# Altium schematic sheet C40_IMB_Upgrade_OVERVIEW.SCHDOC
size 812 x 571 mm; DocumentNumber: 2; SheetNumber: 2; SheetTotal: 7; PageSetup: Record=PageOptions|CenterHorizontal=True|CenterVertical=True|PrintScale=0.46|XCorrection=1.00|YCorrection=1.00|PrintKind=0|BorderSize=5000000|LeftOffset=0|BottomOffset=0|Orientation=2|PaperLength=1000|PaperWidth=1000|Scale=100|PaperSource=259|PrintQuality=600|MediaType=1|DitherType=10|PaperKind=Letter (8.5 x 11")|PrintScaleMode=0
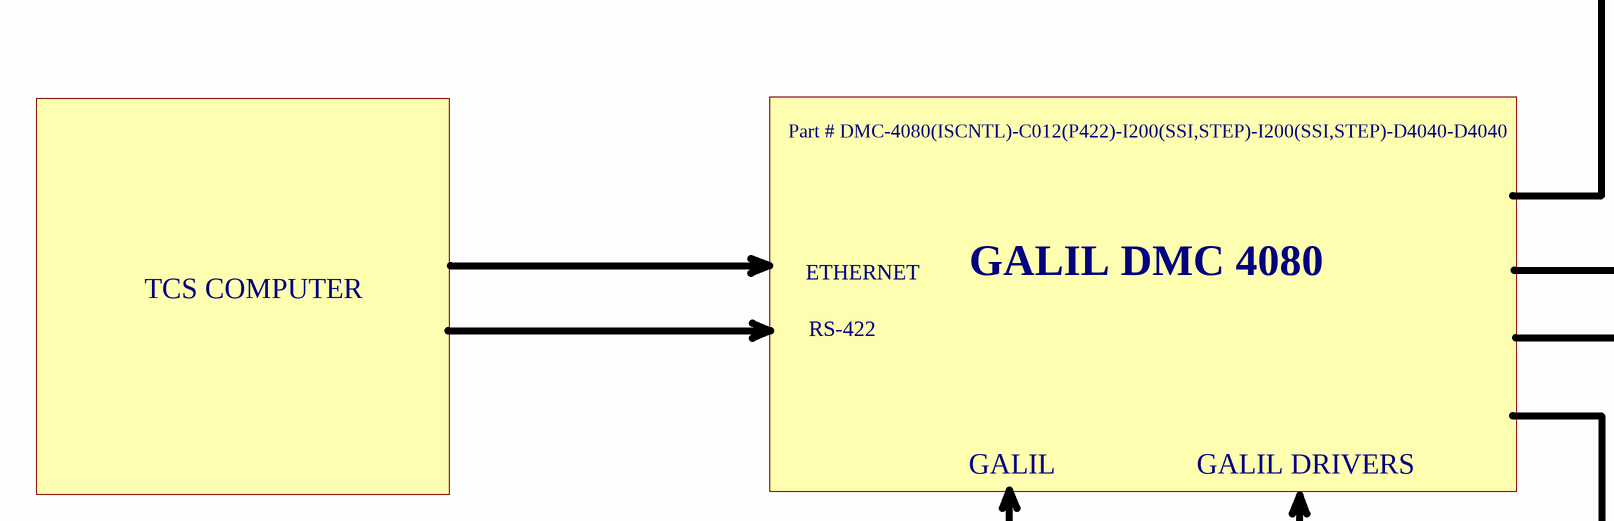
[diagram p0: C40_IMB_Upgrade_OVERVIEW.SCHDOC, top left]
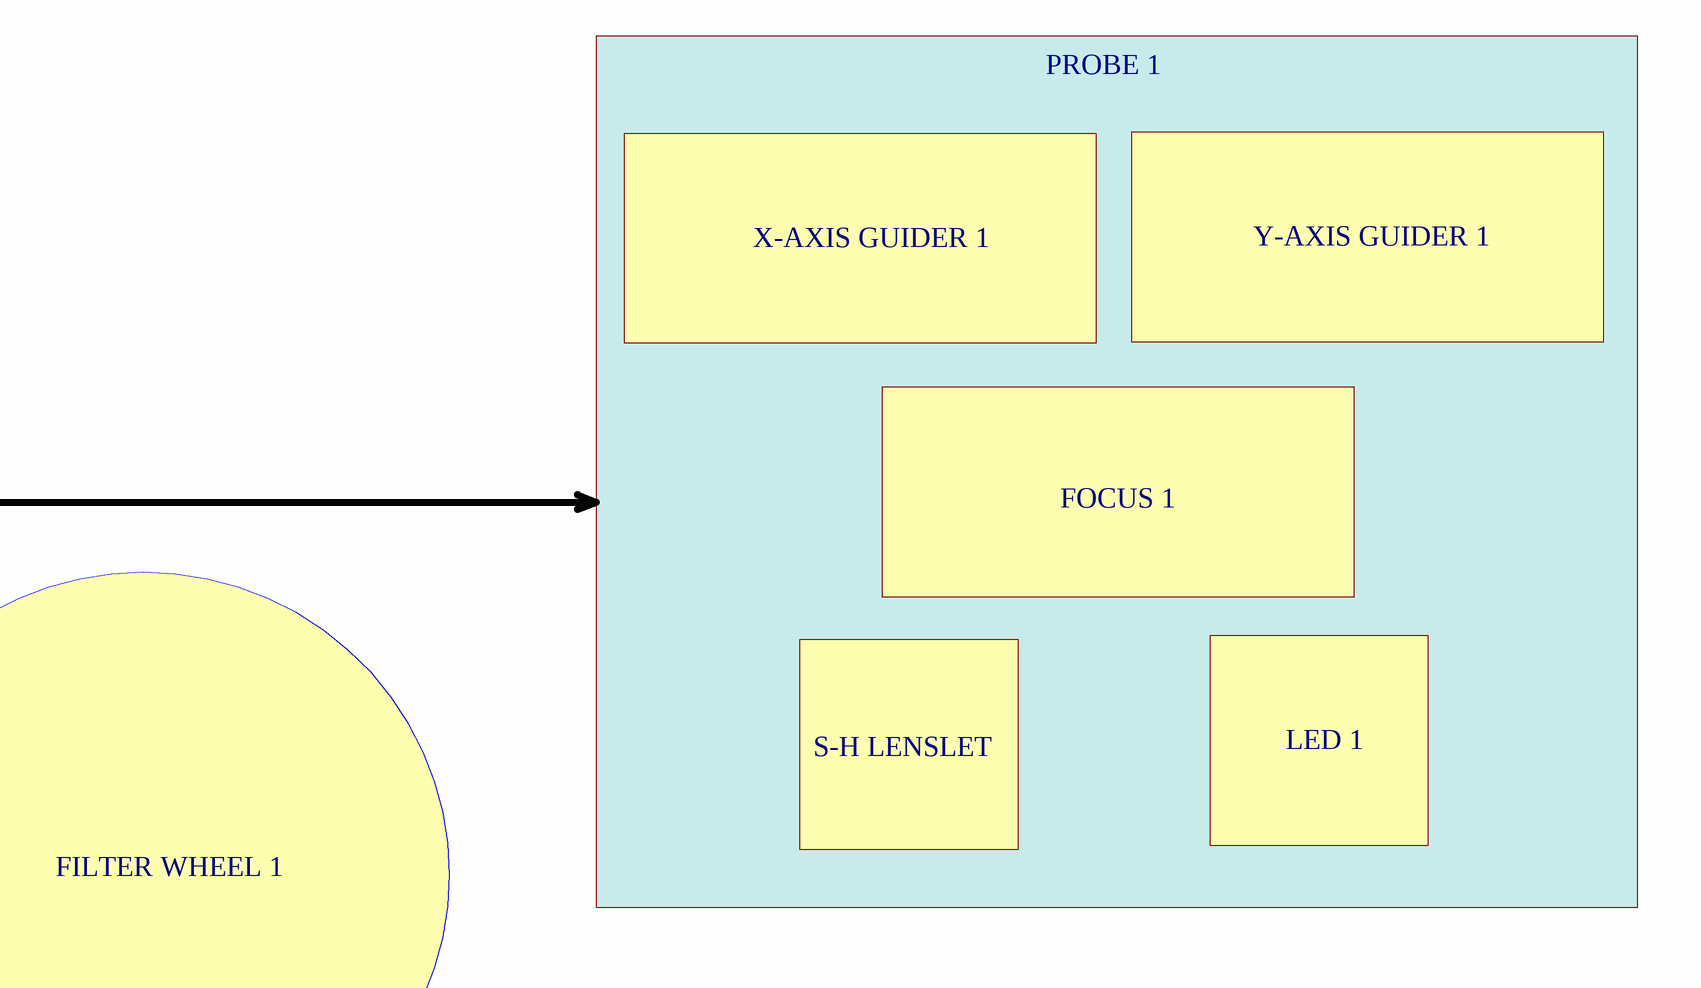
[diagram p1: C40_IMB_Upgrade_OVERVIEW.SCHDOC, top right]
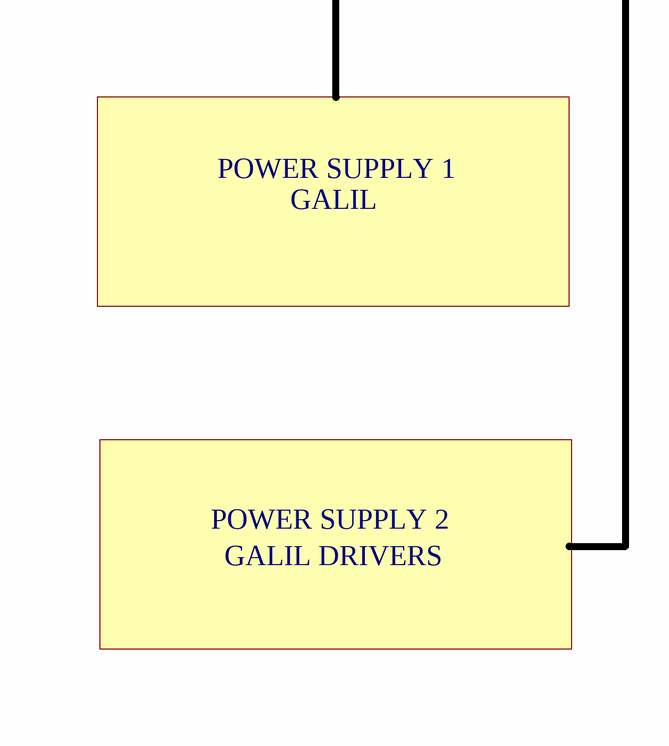
[diagram p2: C40_IMB_Upgrade_OVERVIEW.SCHDOC, bottom left]
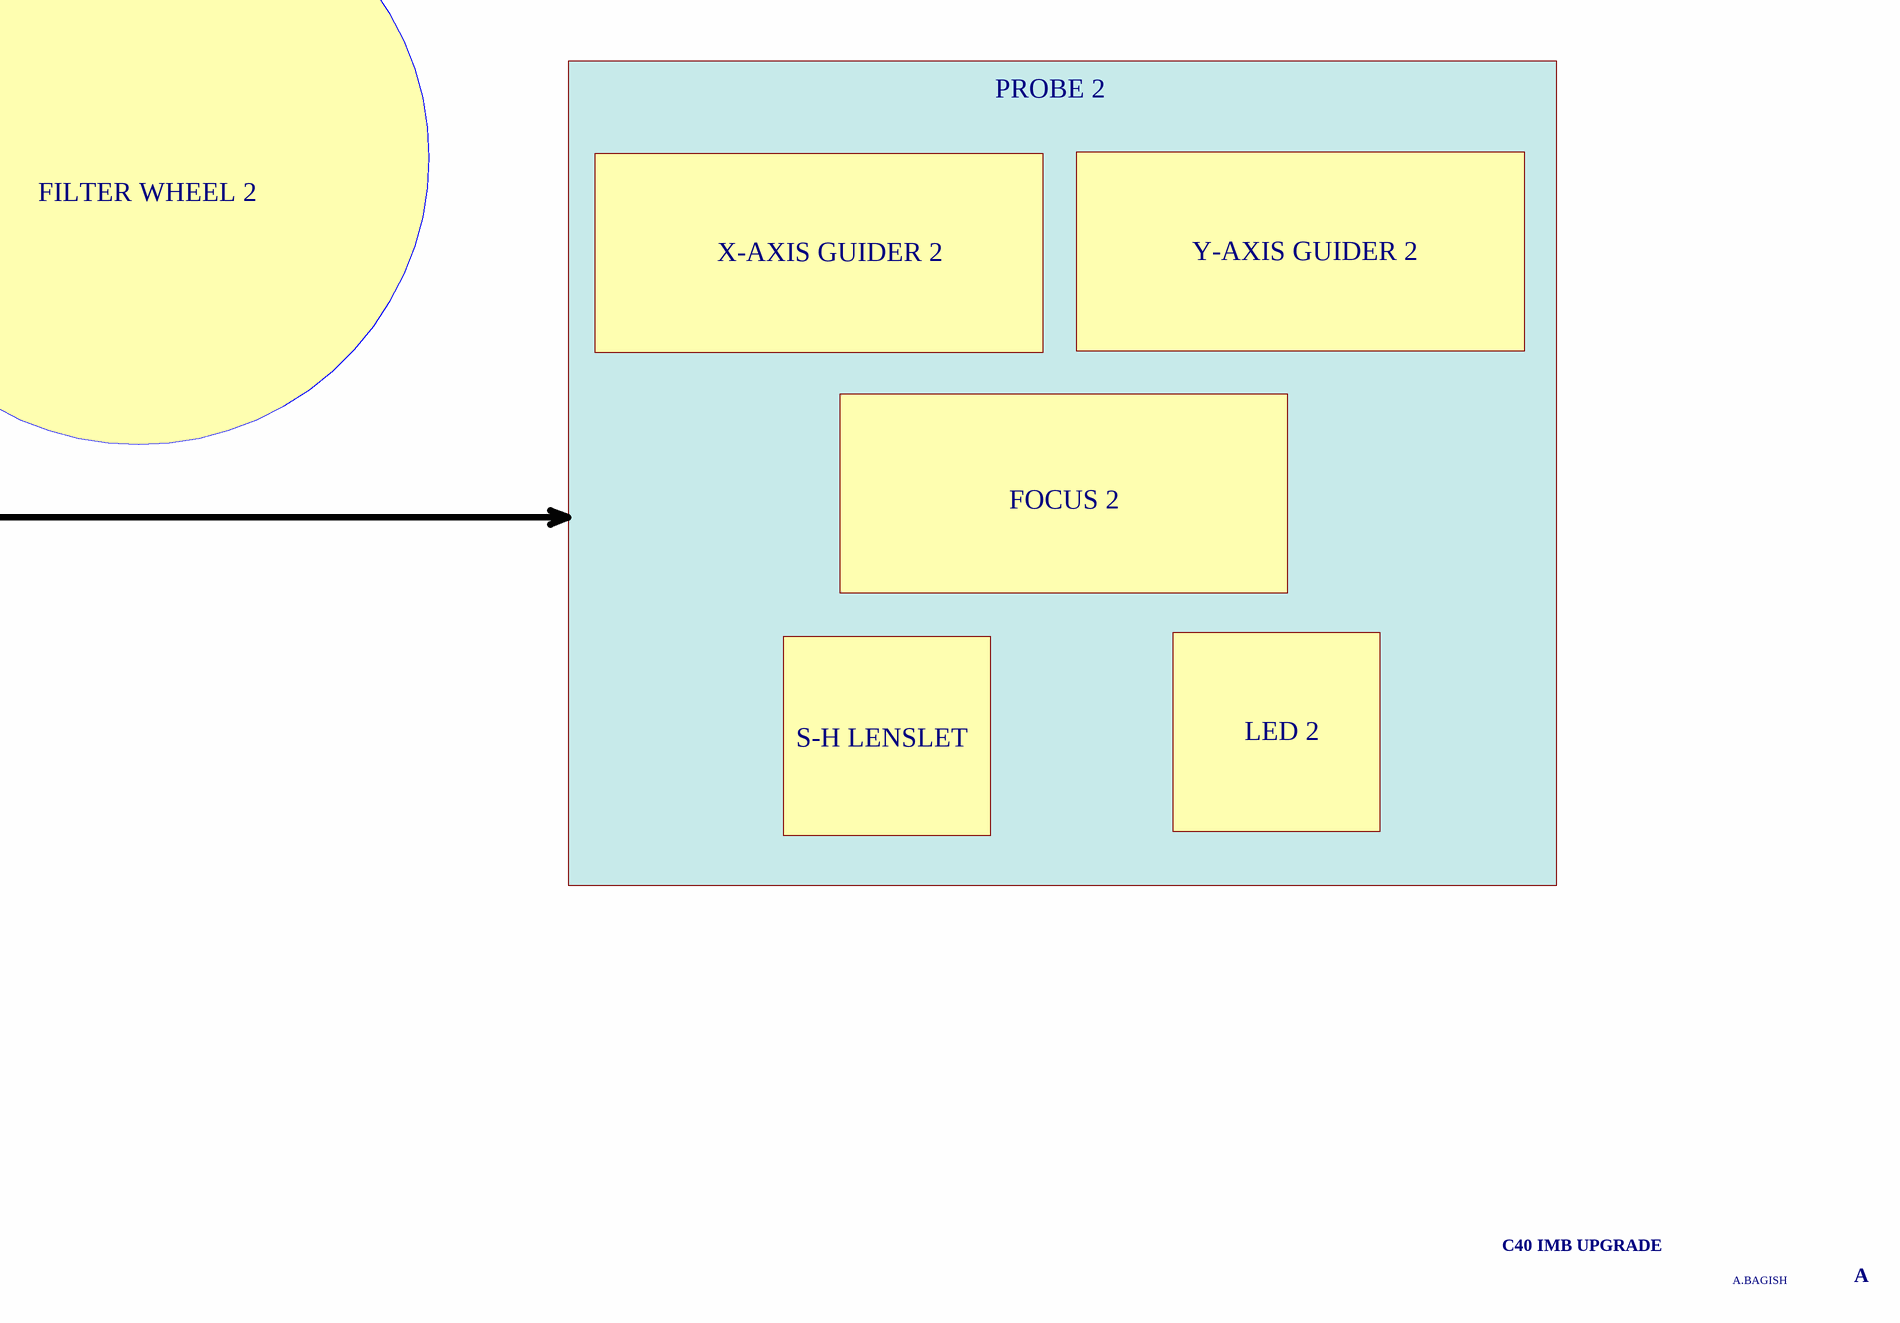
[diagram p3: C40_IMB_Upgrade_OVERVIEW.SCHDOC, bottom right]

## Notes on the sheet
- PROBE 1
- X-AXIS GUIDER 1
- Y-AXIS GUIDER 1
- FOCUS 1
- S-H LENSLET
- LED 1
- FILTER WHEEL 1
- Part # DMC-4080(ISCNTL)-C012(P422)-I200(SSI,STEP)-I200(SSI,STEP)-D4040-D4040
- TCS COMPUTER
- ETHERNET
- GALIL DMC 4080
- RS-422
- GALIL
- GALIL DRIVERS
- PROBE 2
- FILTER WHEEL 2
- X-AXIS GUIDER 2
- Y-AXIS GUIDER 2
- POWER SUPPLY 1
- FOCUS 2
- LED 2
- POWER SUPPLY 2
- C40 IMB UPGRADE
- A.BAGISH
- A
- Carnegie Institution of Washington
- Pasadena, California 91101
- 813 Santa Barbara Street
- The Observatories
- PHONE (626) 577-1122               FAX (626) 795-8136
- Title:
- OCIW
- Size:
- Date:
- File:
- D
- Scale:
- Drawn By:
- Checked By:
- A. Bagish
- alanb
- Revision:
- Sheet          of